# EAGLE design RC_Car (Final_Seven) (EAGLE 9.1.3)
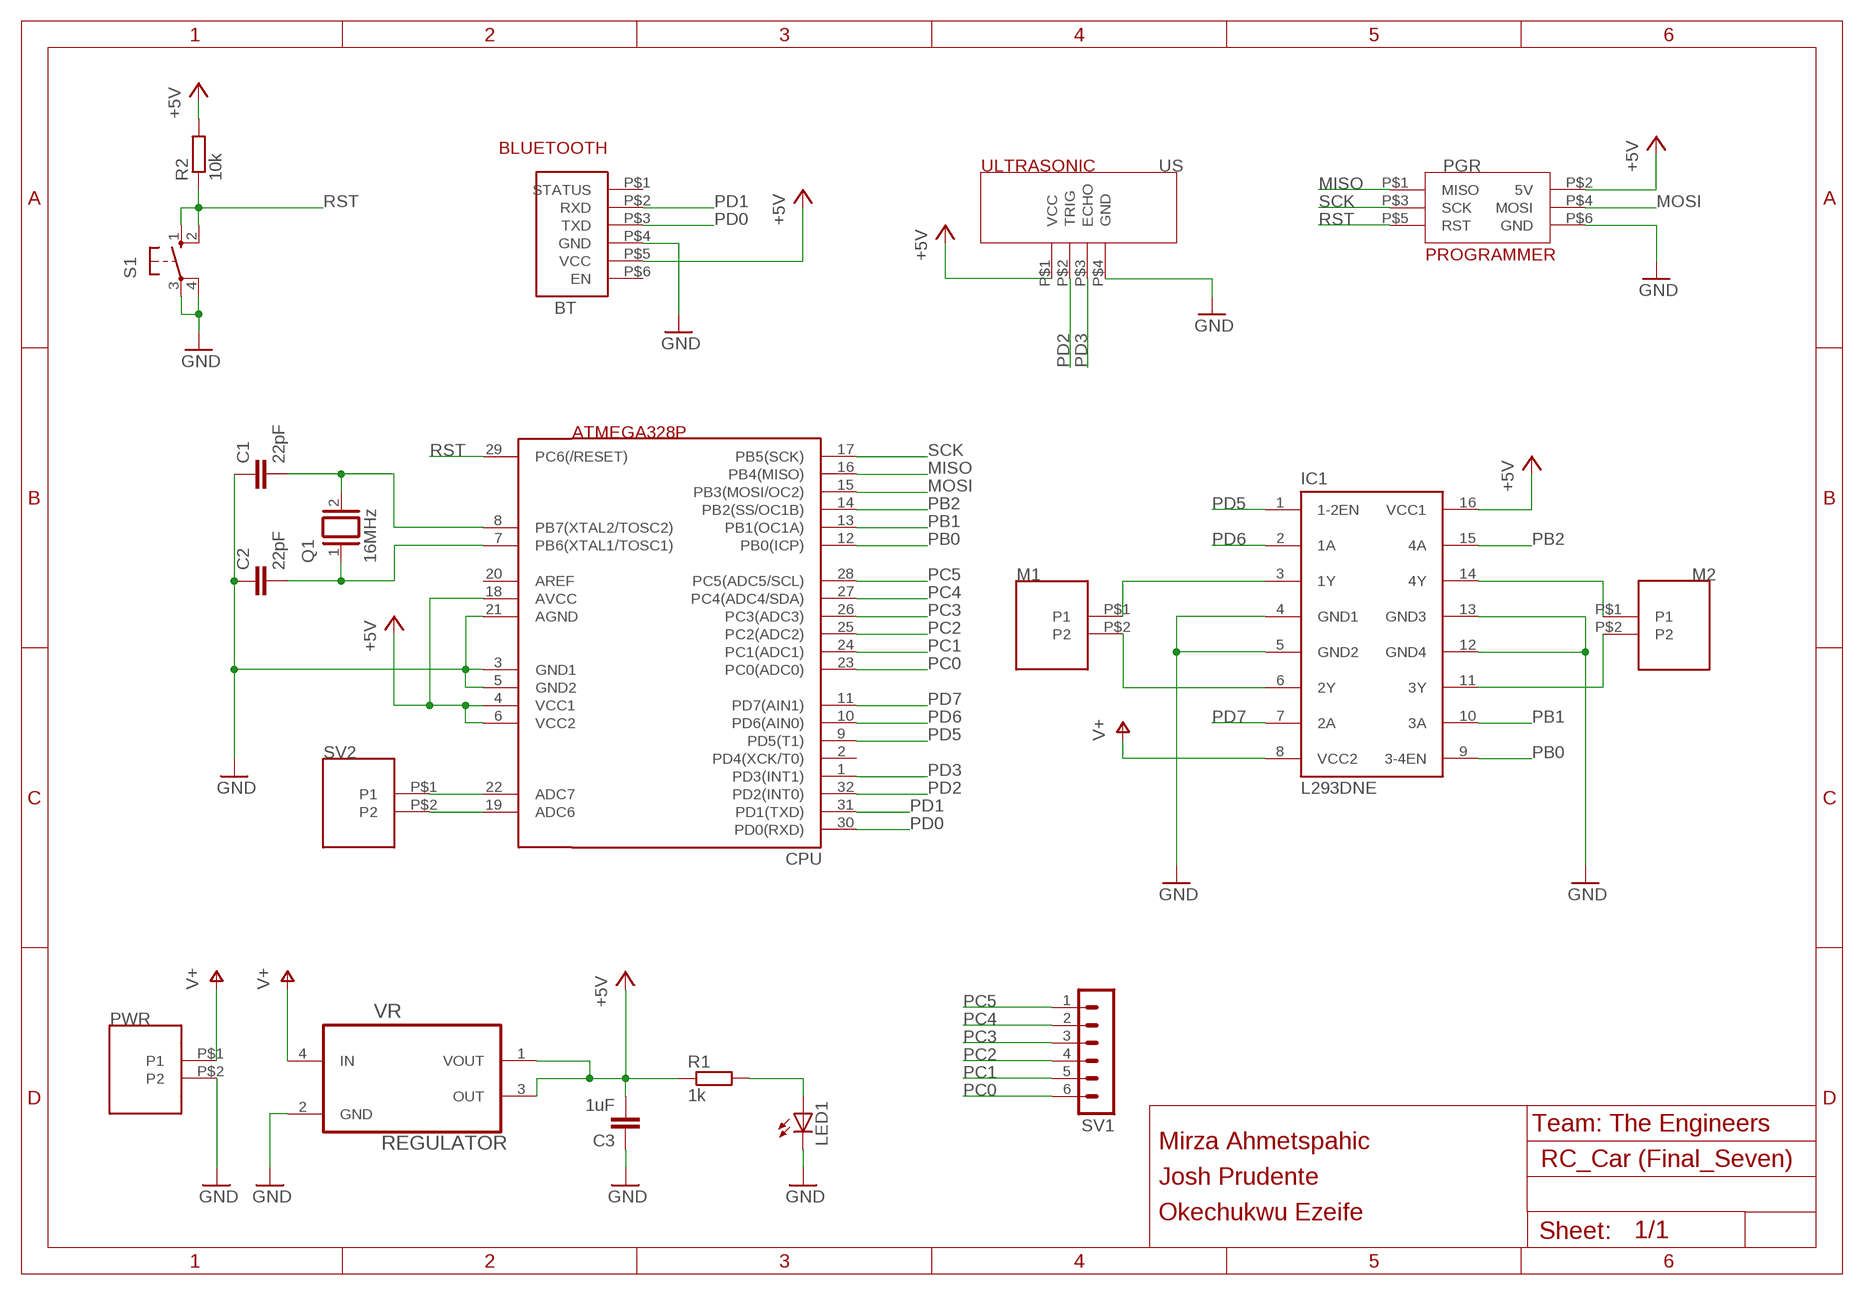
[diagram p0: schematic, sheet 1]

## Parts
BT  BLUETOOTH  [BLUETOOTH]
C1  22pF  C2.5P  [C025-030X050]
C2  22pF  C2.5P  [C025-030X050]
C3  1uF  C2.5P  [C025-030X050]
CPU  ATMEGA328P  [ATMEGA328P]
IC1  L293DNE  [L293DNE]
LED1  LED3MM  [HLMP-D105]
M1  HEADER  [HEADER]
M2  HEADER  [HEADER]
PGR  AVR6AVR6  [AVR6]
PWR  HEADER  [HEADER]
Q1  16MHz  XTAL/S  [QS]
R1  1k  R  [0207/10]
R2  10k  R  [0207/10]
S1  10-XX  [B3F-10XX]
SV1  MA06-1  [MA06-1]
SV2  HEADER  [HEADER]
US  ULTRASONIC  [ULTRASONIC]
VR  REGULATOR  [REGULATOR]

## Nets
+5V: BT.P$5(VCC) C3.2 CPU.4(VCC1) CPU.6(VCC2) CPU.18(AVCC) IC1.16(VCC1) PGR.P$2(5V) R1.1 R2.2 US.P$1(VCC) VR.1(VOUT) VR.3(OUT)
GND: BT.P$4(GND) C1.1 C2.1 C3.1 CPU.3(GND1) CPU.5(GND2) CPU.21(AGND) IC1.4(GND1) IC1.5(GND2) IC1.12(GND4) IC1.13(GND3) LED1.K(C) PGR.P$6(GND) PWR.P$2(P2) S1.3(P) S1.4(P1) US.P$4(GND) VR.2(GND)
MISO: CPU.16(PB4(MISO)) PGR.P$1(MISO)
MOSI: CPU.15(PB3(MOSI/OC2)) PGR.P$4(MOSI)
N$1: IC1.6(2Y) M1.P$2(P2)
N$2: C2.2 CPU.7(PB6(XTAL1/TOSC1)) Q1.1
N$3: C1.2 CPU.8(PB7(XTAL2/TOSC2)) Q1.2
N$4: LED1.A R1.2
N$5: CPU.22(ADC7) SV2.P$1(P1)
N$6: IC1.14(4Y) M2.P$1(P1)
N$7: IC1.11(3Y) M2.P$2(P2)
N$8: IC1.3(1Y) M1.P$1(P1)
N$9: CPU.19(ADC6) SV2.P$2(P2)
PB0: CPU.12(PB0(ICP)) IC1.9(3-4EN)
PB1: CPU.13(PB1(OC1A)) IC1.10(3A)
PB2: CPU.14(PB2(SS/OC1B)) IC1.15(4A)
PC0: CPU.23(PC0(ADC0)) SV1.6
PC1: CPU.24(PC1(ADC1)) SV1.5
PC2: CPU.25(PC2(ADC2)) SV1.4
PC3: CPU.26(PC3(ADC3)) SV1.3
PC4: CPU.27(PC4(ADC4/SDA)) SV1.2
PC5: CPU.28(PC5(ADC5/SCL)) SV1.1
PD0: BT.P$3(TXD) CPU.30(PD0(RXD))
PD1: BT.P$2(RXD) CPU.31(PD1(TXD))
PD2: CPU.32(PD2(INT0)) US.P$2(TRIG)
PD3: CPU.1(PD3(INT1)) US.P$3(ECHO)
PD5: CPU.9(PD5(T1)) IC1.1(1-2EN)
PD6: CPU.10(PD6(AIN0)) IC1.2(1A)
PD7: CPU.11(PD7(AIN1)) IC1.7(2A)
RST: CPU.29(PC6(/RESET)) PGR.P$5(RST) R2.1 S1.1(S) S1.2(S1)
SCK: CPU.17(PB5(SCK)) PGR.P$3(SCK)
V+: IC1.8(VCC2) PWR.P$1(P1) VR.4(IN)
Unconnected: BT.P$1(STATUS) BT.P$6(EN) CPU.2(PD4(XCK/T0)) CPU.20(AREF)

## Notes on the sheet
- US | PGR
- BT
- M1 | M2
- SV2
- CPU
- PWR
- Team: The Engineers
- Mirza Ahmetspahic
- Josh Prudente
- Okechukwu Ezeife

## Library data of the parts
BT = RC_Car:BLUETOOTH
C1-C3 = ee2parts:C: Capacitor
CPU = RC_Car:ATMEGA328P
IC1 = RC_Car:L293DNE: Logic - Buffers, Drivers, and Transceivers Quad Half-Hs; AVAILABILITY: Unavailable; DESCRIPTION: Logic - Buffers, Drivers, and Transceivers Quad Half-Hs; MF: Texas Instruments; MP: L293DNE; PACKAGE: DIP-16 Texas Instruments; PRICE: None
LED1 = ee2parts:LED: LED round, 3mm, 2.54mm lead pitch
M1 M2 PWR SV2 = RC_Car:HEADER
PGR = RC_Car:AVR6
Q1 = special:XTAL/S: CRYSTAL
R1 R2 = ee2parts:R: Resistor
S1 = switch-omron:10-XX: OMRON SWITCH; MPN: B3F-1000; OC_FARNELL: 176432; OC_NEWARK: 36M3542
SV1 = con-lstb:MA06-1: PIN HEADER; OC_FARNELL: unknown; OC_NEWARK: unknown
US = RC_Car:ULTRASONIC
VR = RC_Car:REGULATOR

## Board
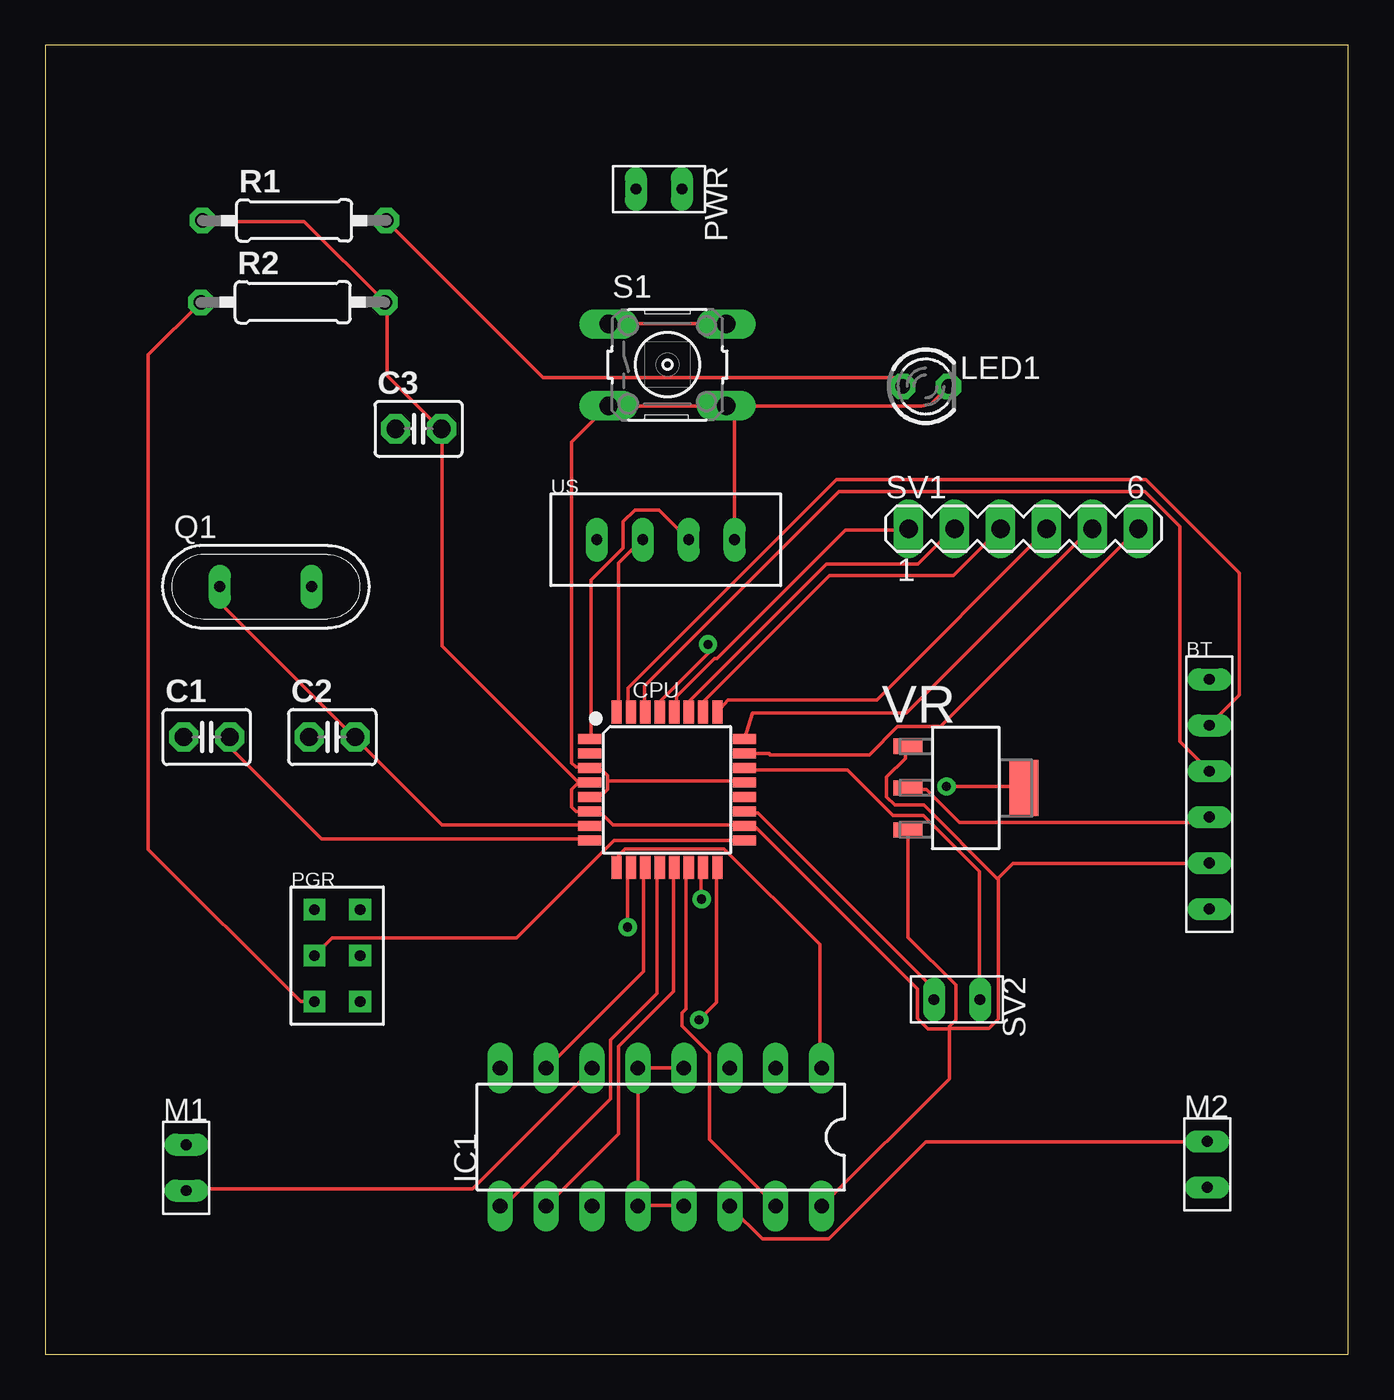
[diagram p1: board, top side]
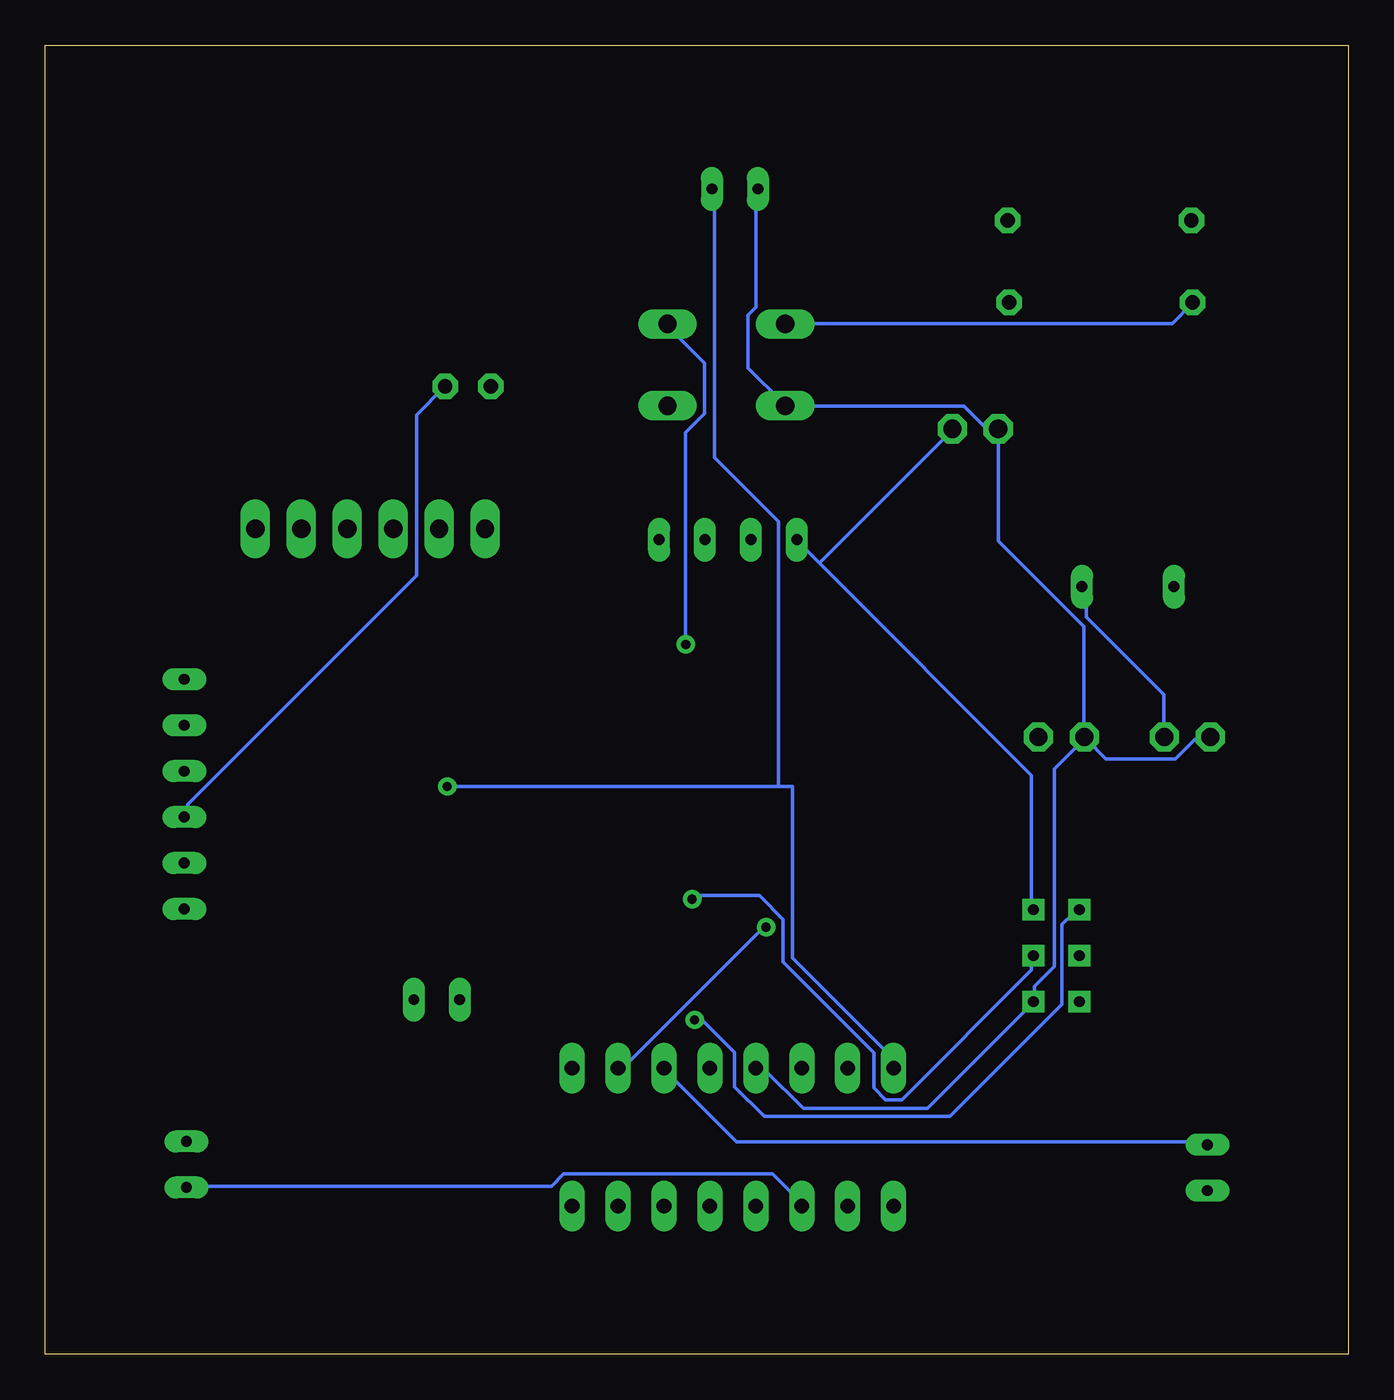
[diagram p2: board, bottom side, seen from below]

Size 72.06 x 72.38 mm. Coordinates in mm from the lower left corner, seen from the top.
Outline: 0,0 72.06,0 72.06,72.38 0,72.38 0,0
Copper layers (1*16): Top 0.035mm / dielectric 1.5mm / Bottom 0.035mm
Design rules "SparkFun": minimum track width 8mil, minimum drill 20mil, track to track 8mil, track to pad 8mil, pad to pad 8mil, via to via 8mil, smd to smd 8mil, copper to edge 10mil, drill to drill 8mil, minimum pad ring 12mil, minimum via ring 10mil, stop-mask expansion 4mil, vias tented up to drill 25mil, thermal gap 10mil

### Footprints (pad centres in the part's own frame; a part is rotated, then mirrored left to right if it is on the bottom)
BLUETOOTH = drill 0.6 long: P$1 0,7.62; P$2 0,5.08; P$3 0,2.54; P$4 0,0; P$5 0,-2.54; P$6 0,-5.08
C025-030X050 = drill 1 octagon: 1 -1.27,0; 2 1.27,0
ATMEGA328P = smd 1.27 x 0.559: 1 -4.293,2.8; 2 -4.293,2; 3 -4.293,1.2; 4 -4.293,0.4; 5 -4.293,-0.4; 6 -4.293,-1.2; 7 -4.293,-2; 8 -4.293,-2.8; 17 4.293,-2.8; 18 4.293,-2; 19 4.293,-1.2; 20 4.293,-0.4; 21 4.293,0.4; 22 4.293,1.2; 23 4.293,2; 24 4.293,2.8 | smd 0.559 x 1.27: 9 -2.8,-4.293; 10 -2,-4.293; 11 -1.2,-4.293; 12 -0.4,-4.293; 13 0.4,-4.293; 14 1.2,-4.293; 15 2,-4.293; 16 2.8,-4.293; 25 2.8,4.293; 26 2,4.293; 27 1.2,4.293; 28 0.4,4.293; 29 -0.4,4.293; 30 -1.2,4.293; 31 -2,4.293; 32 -2.8,4.293
L293DNE = drill 0.813 long: 1 -3.81,8.89; 2 -3.81,6.35; 3 -3.81,3.81; 4 -3.81,1.27; 5 -3.81,-1.27; 6 -3.81,-3.81; 7 -3.81,-6.35; 8 -3.81,-8.89; 9 3.81,-8.89; 10 3.81,-6.35; 11 3.81,-3.81; 12 3.81,-1.27; 13 3.81,1.27; 14 3.81,3.81; 15 3.81,6.35; 16 3.81,8.89
HLMP-D105 = drill 0.8 octagon: A -1.27,0; K 1.27,0
HEADER = drill 0.6 long: P$1 0,1.27; P$2 0,-1.27
AVR6 = drill 0.6 square: P$1 -3.81,2.54; P$2 -1.27,2.54; P$3 -3.81,0; P$4 -1.27,0; P$5 -3.81,-2.54; P$6 -1.27,-2.54
QS = drill 0.61 long: 1 -2.54,0; 2 2.54,0
0207/10 = drill 0.8 octagon: 1 -5.08,0; 2 5.08,0
B3F-10XX = drill 1.016 long: 1 -3.251,2.261; 2 3.251,2.261; 3 -3.251,-2.261; 4 3.251,-2.261
MA06-1 = drill 1.016 long: 1 -6.35,0; 2 -3.81,0; 3 -1.27,0; 4 1.27,0; 5 3.81,0; 6 6.35,0
ULTRASONIC = drill 0.6 long: P$1 -5.08,0; P$2 -2.54,0; P$3 0,0; P$4 2.54,0
REGULATOR = smd 1.6 x 0.838: 1 -3.2,2.311; 2 -3.2,0; 3 -3.2,-2.311 | smd 1.6 x 3.099: 4 3.2,0

### Placement (x,y rotation side)
BT  64.37,29.7 0 top
C1  8.92,34.13 0 top
C2  15.87,34.13 0 top
C3  20.64,51.17 0 top
CPU  34.38,31.21 0 top
IC1  34.04,12.01 270 top
LED1  48.68,53.52 0 top
M1  7.8,10.32 0 top
M2  64.25,10.5 0 top
PGR  18.69,22.04 0 top
PWR  33.93,64.43 270 top
Q1  12.19,42.44 0 top
R1  13.77,62.69 0 top
R2  13.69,58.17 0 top
S1  34.4,54.71 0 top
SV1  54.09,45.65 0 top
SV2  50.41,19.61 270 top
US  35.58,45.04 0 top
VR  50.9,31.31 0 top

### Tracks (layer width: path | path; a pad name or v marks a point on that pad's centre or on a via)
+5V
  Top 0.203: 29.5,31.62 29.11,31.23 29.11,30.26 29.35,30.02 30.02,30.02 CPU.6 30.18,29.87 30.79,29.87 31.39,29.26 38.56,29.26 CPU.18 38.71,29.11 39.32,29.11 48.23,20.2 48.23,18.57 48.8,18 49.99,18 | 29.57,31.55 30.02,31.55 CPU.4 29.57,31.55 | 49.99,18.02 49.99,18.14 50.35,18.5 50.35,20.41 47.7,23.06 47.7,28.96 VR.3 | IC1.16 42.98,8.23 49.99,15.24 49.99,18 | 52.7,26.33 52.7,18.55 52.17,18.02 49.99,18.02 | VR.1 47.55,33.53 47.55,32.95 46.51,31.91 46.51,30.82 46.98,30.36 48.59,30.36 52.66,26.29 52.7,26.33 | 52.7,26.33 53.49,27.13 64.31,27.13 BT.P$5 | R1.1 8.84,62.64 14.33,62.64 18.75,58.22 R2.2 18.9,58.06 18.9,54.1 21.79,51.21 C3.2 21.95,51.05 21.95,39.17 29.5,31.62 | 29.5,31.62 29.57,31.55 | 49.99,18 49.99,18.02
  Bottom 0.203: 29.26,43.74 30.48,44.96 US.P$1 | 29.26,43.74 17.53,32 17.53,24.69 PGR.P$2 | 29.26,43.74 21.95,51.05 C3.2
GND
  Top 0.203: IC1.13 35.2,8.23 32.92,8.23 IC1.12 32.77,8.23 32.77,15.7 IC1.5 32.92,15.85 35.2,15.85 IC1.4 | VR.2 47.7,31.24 48.71,31.24 50.54,29.41 64.16,29.41 64.31,29.57 BT.P$4 | 38.1,52.12 38.1,45.11 US.P$4 | 38.1,52.12 37.8,52.43 S1.4 | 38.1,52.12 S1.4 | 31.09,31.7 31.09,32.01 30.79,32.31 30.18,32.31 CPU.3 30.02,32.46 29.35,32.46 29.11,32.7 29.11,50.44 31.09,52.43 S1.3 31.24,52.43 37.64,52.43 S1.4 | 31.09,31.7 31.09,31.24 30.79,30.94 30.18,30.94 CPU.5 | 31.09,31.7 38.56,31.7 CPU.21 | S1.4 37.69,52.41 48.46,52.41 48.96,52.53 LED1.K
  Bottom 0.203: C2.1 14.63,33.98 16.26,32.35 16.26,21.45 17.37,20.33 17.37,19.51 PGR.P$6 17.53,19.36 23.29,13.59 30.15,13.59 32.26,15.7 32.77,15.7 IC1.5 | C1.1 7.77,33.98 8.5,33.98 9.57,32.91 13.4,32.91 14.48,33.98 C2.1 | BT.P$4 64.17,29.76 64.17,30.41 51.54,43.05 51.54,51.94 49.99,53.49 LED1.K | PWR.P$2 32.77,64.31 32.77,57.89 33.2,57.45 33.2,54.53 31.24,52.58 S1.3 31.09,52.43 21.26,52.43 20.04,51.21 19.51,51.21 C3.1 19.36,51.05 19.36,44.96 14.63,40.23 14.63,34.14 C2.1
MISO  (via drill 0.51)
  Top 0.203: v36.15,18.49 37.11,19.45 37.11,26.87 CPU.16
  Bottom 0.203: PGR.P$1 15.6,24.01 15.84,23.77 15.84,19.34 22.03,13.14 32.3,13.14 33.94,14.78 33.94,16.69 35.73,18.49 v36.15,18.49
MOSI  (via drill 0.51)
  Top 0.203: CPU.15 36.25,26.8 36.25,25.2 v36.29,25.16
  Bottom 0.203: PGR.P$4 17.53,21.95 17.53,21.25 24.7,14.07 25.59,14.07 26.24,14.72 26.24,16.67 31.26,21.69 31.26,24.05 32.58,25.36 36.09,25.36 v36.29,25.16
N$1
  Top 0.203: M1.P$2 7.92,9.14 23.62,9.14 30.18,15.7 IC1.6
N$2
  Top 0.203: CPU.7 30.02,29.26 21.95,29.26 17.22,33.98 C2.2 17.07,34.14 9.75,41.45 9.75,42.37 Q1.1
N$3
  Top 0.203: CPU.8 30.02,28.5 15.28,28.5 10.28,33.49 C1.2
  Bottom 0.203: Q1.2 14.49,42.44 14.49,40.75 10.21,36.47 10.21,34.14 C1.2
N$4
  Top 0.203: LED1.A 47.36,54.01 27.53,54.01 18.9,62.64 R1.2
N$5
  Top 0.203: CPU.22 38.71,32.31 44.35,32.31 46.86,29.8 48.56,29.8 51.66,26.69 51.66,19.66 SV2.P$1
N$6
  Top 0.203: M2.P$1 64.16,11.73 48.7,11.73 43.34,6.37 39.65,6.37 37.95,8.08 IC1.14
N$7
  Bottom 0.203: M2.P$2 64.16,9.3 44.07,9.3 43.39,9.97 31.85,9.97 30.23,8.35 IC1.11
N$8
  Bottom 0.203: M1.P$1 7.92,11.73 33.83,11.73 37.8,15.7 IC1.3
N$9
  Top 0.203: CPU.19 38.69,29.93 39.4,29.93 49.07,20.26 49.07,19.66 SV2.P$2
PB0
  Top 0.203: CPU.12 33.83,26.82 33.83,19.95 31.26,17.38 31.26,14.11 25.4,8.25 IC1.9
PB1
  Top 0.203: CPU.13 34.75,26.82 34.75,20.07 31.69,17.01 31.69,12.18 27.74,8.23 IC1.10
PB2
  Top 0.203: CPU.14 35.43,26.71 35.43,19.1 35.2,18.87 35.2,18.16 36.74,16.63 36.74,11.88 40.39,8.23 IC1.15
PC0
  Top 0.203: SV1.6 60.35,45.57 49.49,34.71 47.13,34.71 45.56,33.14 40.08,33.14 40.05,33.21 CPU.23
PC1
  Top 0.203: CPU.24 39.09,35.46 47.62,35.46 57.81,45.65 SV1.5
PC2
  Top 0.203: CPU.25 37.76,36.19 45.98,36.19 55.36,45.57 SV1.4
PC3
  Top 0.203: SV1.3 52.73,45.57 50.21,43.05 43.35,43.05 36.38,36.08 CPU.26
PC4
  Top 0.203: CPU.27 35.66,35.51 35.66,36.16 43.19,43.69 48.26,43.69 50.14,45.57 SV1.2
PC5
  Top 0.203: CPU.28 34.9,35.51 34.9,36.36 37,38.46 37.15,38.46 44.26,45.57 47.7,45.57 SV1.1
PD0
  Top 0.203: BT.P$3 64.31,32.31 62.74,33.88 62.74,45.76 60.81,47.69 43.87,47.69 33.14,36.96 33.14,35.54 CPU.30
PD1
  Top 0.203: BT.P$2 64.47,34.9 66.02,36.45 66.02,43.2 60.86,48.35 43.74,48.35 32.22,36.84 32.22,35.66 CPU.31
PD2
  Top 0.203: CPU.32 31.7,35.51 31.7,43.74 32.92,44.96 US.P$2
PD3
  Top 0.203: CPU.1 30.18,34.14 30.18,42.8 31.96,44.58 31.96,46.03 32.61,46.68 33.94,46.68 35.51,45.11 US.P$3
PD5
  Top 0.203: CPU.9 31.7,26.98 31.7,27.58 32.06,27.95 37.53,27.95 42.82,22.66 42.82,15.85 IC1.1
PD6  (via drill 0.51)
  Top 0.203: v32.2,23.61 32.2,26.74 CPU.10
  Bottom 0.203: IC1.2 40.14,15.82 32.34,23.61 v32.2,23.61
PD7
  Top 0.203: CPU.11 33.07,26.82 33.07,21.18 27.74,15.85 IC1.7
RST  (via drill 0.51)
  Top 0.203: CPU.29 33.98,36.09 36.65,38.75 v36.65,39.25 | S1.1 31.24,57 37.64,57 S1.2 | PGR.P$5 14.13,19.5 5.7,27.92 5.7,55.26 R2.1
  Bottom 0.203: v36.65,39.25 36.65,50.97 35.61,52 35.61,54.82 37.64,56.84 S1.2 | S1.1 31.09,57 9.75,57 8.61,58.14 R2.1
SCK
  Top 0.203: CPU.17 31.45,28.41 26.07,23.02 15.86,23.02 14.94,22.1 PGR.P$3
V+  (via drill 0.51)
  Top 0.203: v49.84,31.39 53.95,31.39 VR.4
  Bottom 0.203: 31.51,31.39 31.51,46.03 35.05,49.57 35.05,64.31 PWR.P$1 | 31.51,31.39 v49.84,31.39 | 31.51,31.39 30.73,31.39 30.73,21.93 25.15,16.34 IC1.8